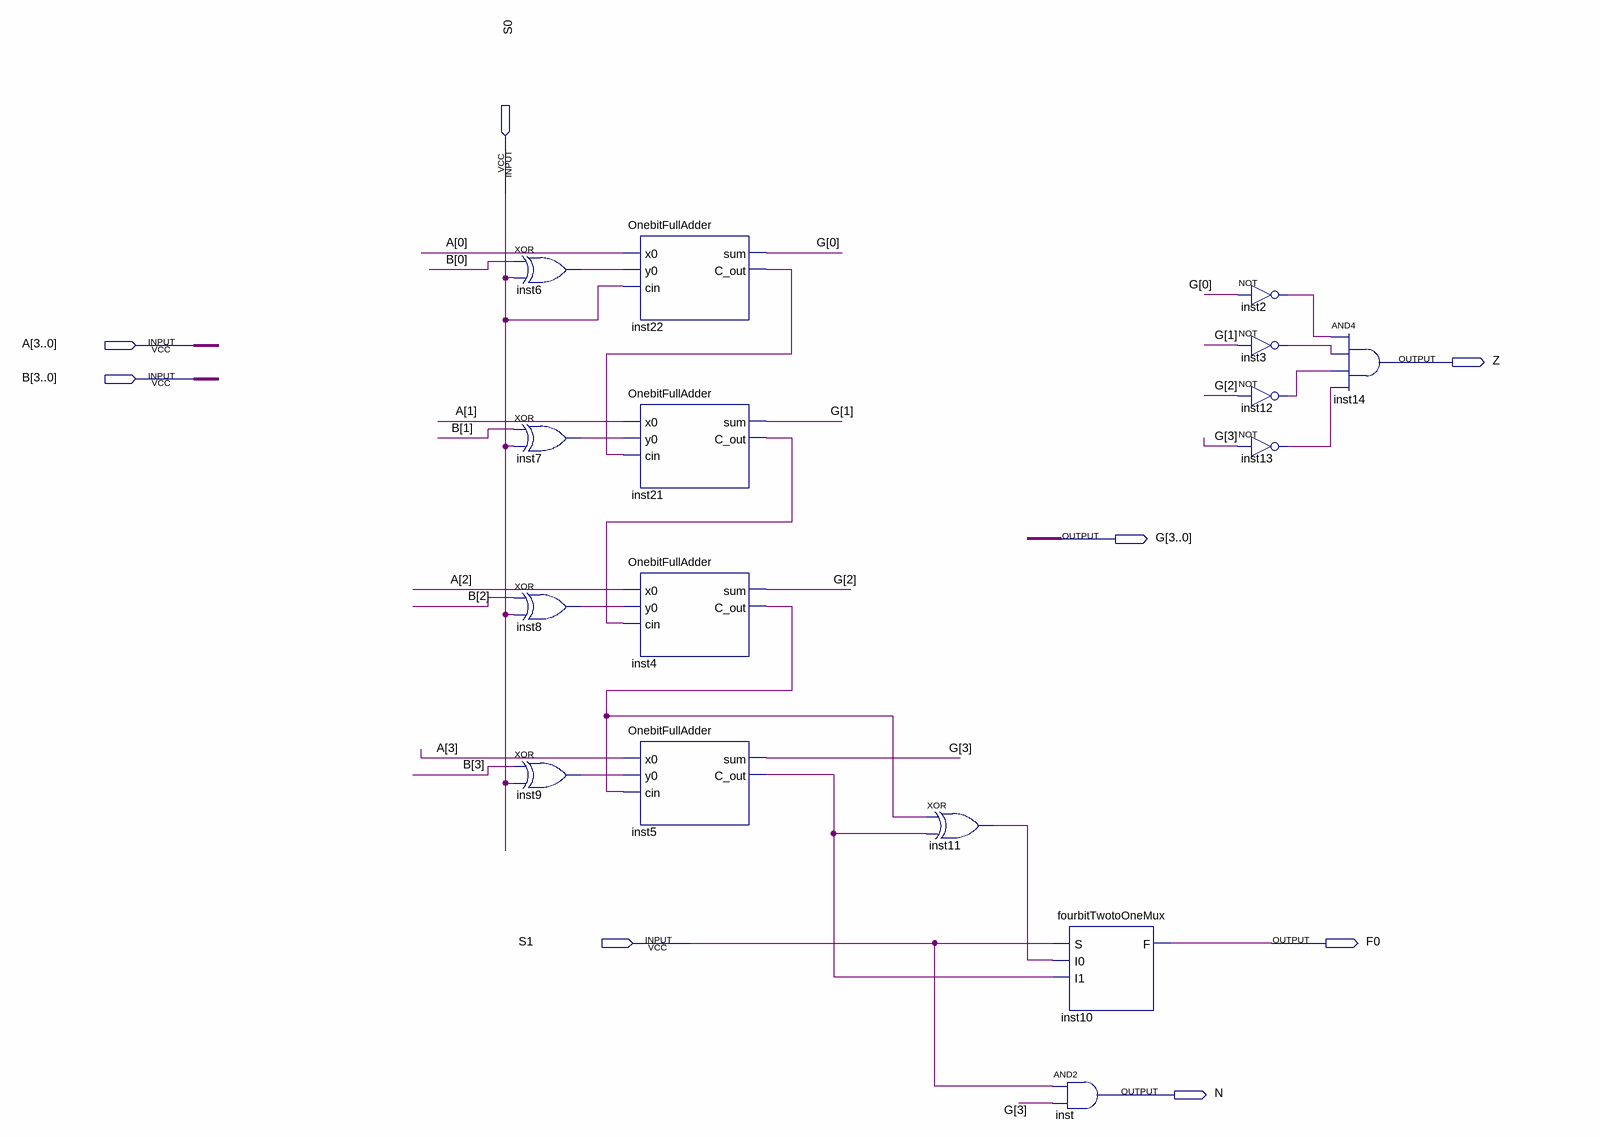
[diagram p0: schematic sheet]
// Quartus schematic fourbitAU.bdf as structural Verilog: 16 symbols, 8 pins
module fourbitAU (
  input  S0,
  input  [3:0] A,
  input  [3:0] B,
  input  S1,
  output Z,
  output [3:0] G,
  output F0,
  output N
);

  wire inst2_out, inst3_out, inst4_c_out, inst5_c_out, inst6_out, inst7_out, inst8_out, inst9_out,
       inst11_out, inst12_out, inst13_out, inst21_c_out, inst22_c_out;

  xor inst6 (inst6_out, B[0], S0);
  xor inst7 (inst7_out, B[1], S0);
  xor inst8 (inst8_out, B[2], S0);
  xor inst9 (inst9_out, B[3], S0);
  OnebitFullAdder inst22 (.x0(A[0]), .y0(inst6_out), .cin(S0), .sum(G[0]), .C_out(inst22_c_out));
  OnebitFullAdder inst21 (.x0(A[1]), .y0(inst7_out), .cin(inst22_c_out), .sum(G[1]), .C_out(inst21_c_out));
  OnebitFullAdder inst4 (.x0(A[2]), .y0(inst8_out), .cin(inst21_c_out), .sum(G[2]), .C_out(inst4_c_out));
  OnebitFullAdder inst5 (.x0(A[3]), .y0(inst9_out), .cin(inst4_c_out), .sum(G[3]), .C_out(inst5_c_out));
  xor inst11 (inst11_out, inst4_c_out, inst5_c_out);
  fourbitTwotoOneMux inst10 (.S(S1), .I0(inst11_out), .I1(inst5_c_out), .F(F0));
  and inst (N, S1, G[3]);
  not inst2 (inst2_out, G[0]);
  not inst3 (inst3_out, G[1]);
  not inst12 (inst12_out, G[2]);
  not inst13 (inst13_out, G[3]);
  and inst14 (Z, inst2_out, inst3_out, inst12_out, inst13_out);
endmodule
